# Altium project LTE-GNSS Asset Tracker.PrjPcb (part 2 of 3)

## Sheet Battery.SchDoc
size A4
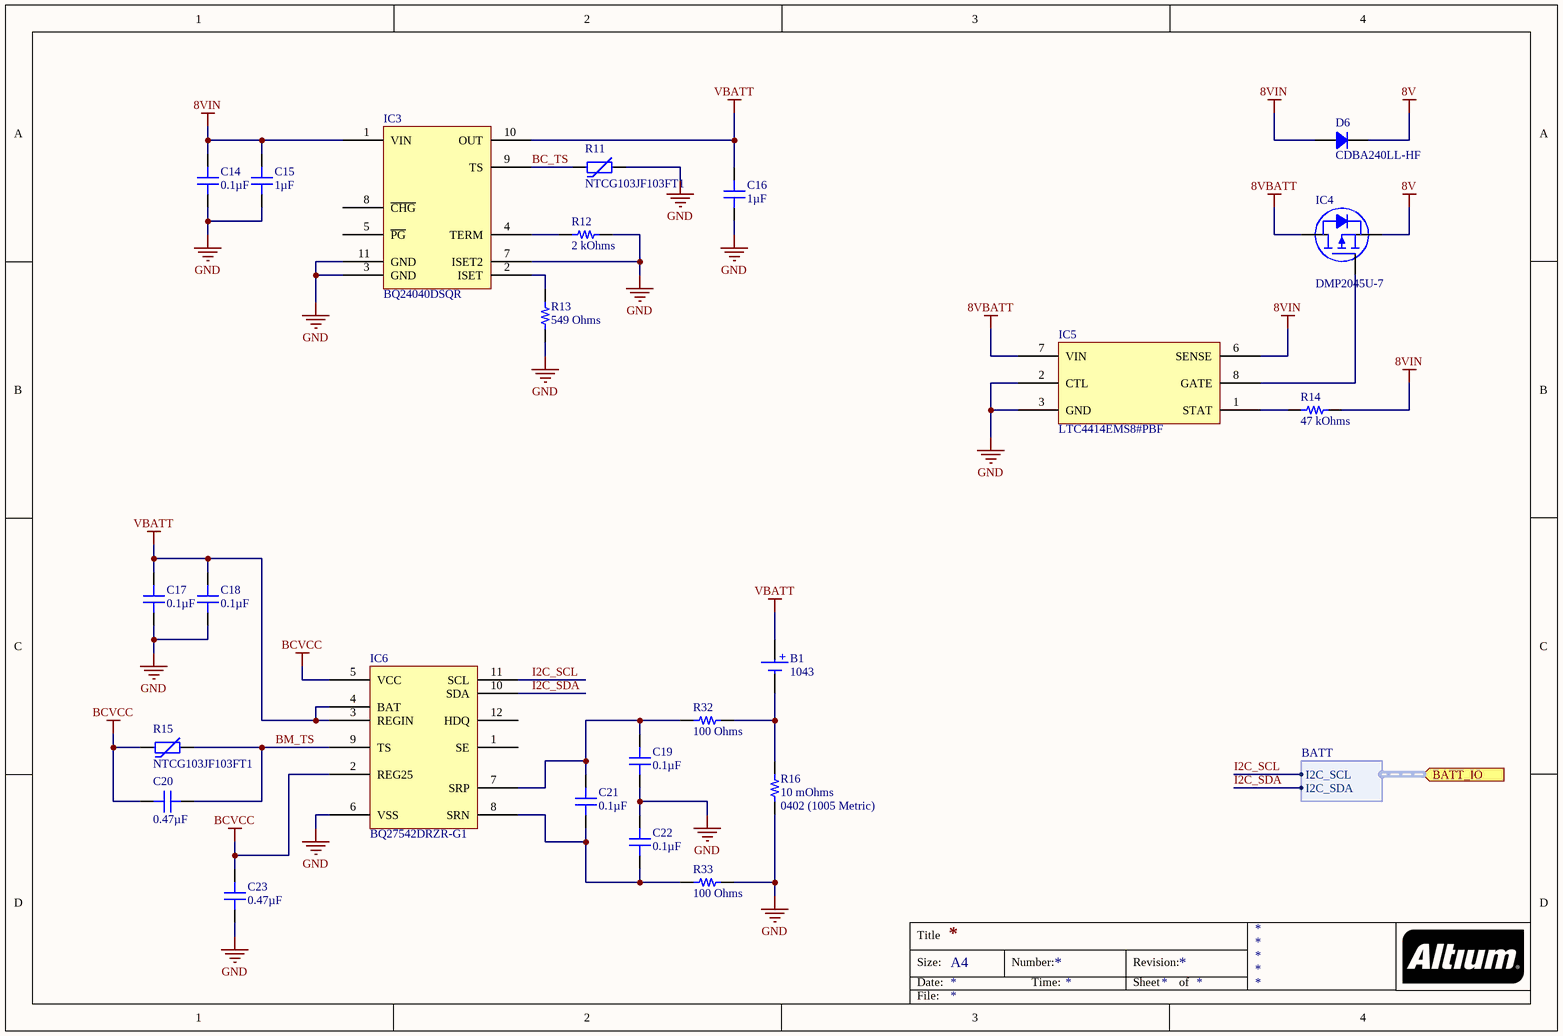
[diagram p3: Battery.SchDoc]

### Parts
B1  1043  [KEYSTONE 1043]
C14  0.1µF  [CAP 0201_0603]
C15  1µF  [CAP 0402_1005]
C16  1µF  [CAP 0402_1005]
C17  0.1µF  [CAP 0201_0603]
C18  0.1µF  [CAP 0201_0603]
C19  0.1µF  [CAP 0201_0603]
C20  0.47µF  [CAP 0201_0603]
C21  0.1µF  [CAP 0201_0603]
C22  0.1µF  [CAP 0201_0603]
C23  0.47µF  [CAP 0201_0603]
D6  CDBA240LL-HF  [DO214AC SMA]
IC3  BQ24040DSQR  [TI PWSON-10 DSQ]
IC4  DMP2045U-7  [DIODES SOT-23-3]
IC5  LTC4414EMS8#PBF  [ANALOG MSOP-8 RM-8]
IC6  BQ27542DRZR-G1  [TI SON-12 DRZ]
R11  NTCG103JF103FT1  [NTC 0402_1005]
R12  2 kOhms  [RES 0201_0603]
R13  549 Ohms  [RES 0201_0603]
R14  47 kOhms  [RES 0201_0603]
R15  NTCG103JF103FT1  [NTC 0402_1005]
R16  10 mOhms  Package / Case: 0402 (1005 Metric)  [STACKPOLE CSR0402]
R32  100 Ohms  [RES 0201_0603]
R33  100 Ohms  [RES 0201_0603]

### Ports
BATT_IO (in, harness BATT)

### Harnesses
BATT: I2C_SCL, I2C_SDA

### Nets
8V: D6.2 IC4.2(S)
8VBATT: IC4.3(D) IC5.7(VIN)
8VIN: C14.2 C15.2 D6.1 IC3.1(VIN) IC5.6(SENSE) R14.2
BCVCC: C20.1 C23.2 IC6.2(REG25) IC6.5(VCC) R15.1
GND: C14.1 C15.1 C16.1 C17.1 C18.1 C19.1 C22.2 C23.1 IC3.3(GND) IC3.7(ISET2) IC3.11(GND) IC5.2(CTL) IC5.3(GND) IC6.6(VSS) R11.2 R12.2 R13.1 R16.1 R33.2
VBATT: B1.1(+) C16.2 C17.2 C18.2 IC3.10(OUT) IC6.3(REGIN) IC6.4(BAT)
BC_TS: IC3.9(TS) R11.1
BM_TS: C20.2 IC6.9(TS) R15.2
I2C_SCL: IC6.11(SCL) ; port BATT_IO.I2C_SCL
I2C_SDA: IC6.10(SDA) ; port BATT_IO.I2C_SDA
NetB1_2: B1.2(-) R16.2 R32.2
NetC19_2: C19.2 C21.2 IC6.7(SRP) R32.1
NetC21_1: C21.1 C22.1 IC6.8(SRN) R33.1
NetIC3_2: IC3.2(ISET) R13.2
NetIC3_4: IC3.4(TERM) R12.1
NetIC4_1: IC4.1(G) IC5.8(GATE)
NetIC5_1: IC5.1(STAT) R14.1

Not connected (* = marked no-connect by the designer): IC3 5(~{PG}) 8(~{CHG}); IC6 1(SE) 12(HDQ)

### Notes on the sheet
- Title
- Size:
- Date:
- A4
- Number:
- Time:
- Revision:
- Sheet
- of
- File:

### Library data of the parts
B1 = 1043: BATTERY HOLDER 18650 PC PIN; Manufacturer: Keystone Electronics; Battery Cell Size: 18650; Battery Type, Function: Cylindrical, Holder; Number of Cells: 1; Style: Holder (Open); Part Number: 1043; ComponentLink1Description: Datasheet; ComponentLink1URL: http://keyelco.com/userAssets/file/M65p27.pdf; ComponentLink2Description: DigiKey Link; ComponentLink2URL: http://digikey.com/product-detail/en/keystone-electronics/1043/36-1043-ND/2745669; Height Above Board: 0.585" (14.86mm); LastUpdated: 02/02/2020 09:19:56; Lifecycle Status: Active; Minimum Order: 1; Mounting Type: PCB, Through Hole; Operating Temperature: -50°C ~ 145°C; Packaging: Unknown; PartId: 2; Part Status: Active; Price: 2.58; Series: -; Supplier 1: DigiKey; Supplier Part Number 1: 36-1043-ND; Termination Style: PC Pin
C14 C17-C19 C21 C22 = GRM033R61C104ME84D: CAP CER 0.1UF 16V X5R 0201; Manufacturer: Murata Electronics; Tolerance: ±20%; Part Number: GRM033R61C104ME84D; Value: 0.1µF; Applications: General Purpose; Capacitance: 0.1µF; ComponentLink1Description: Datasheet; ComponentLink1URL: https://search.murata.co.jp/Ceramy/image/img/A01X/G101/ENG/GRM033R61C104ME84-01.pdf; ComponentLink2Description: DigiKey Link; ComponentLink2URL: http://digikey.com/product-detail/en/murata-electronics/GRM033R61C104ME84D/490-9986-1-ND/5026291; Device Package: 0201 (0603 Metric); LastUpdated: 21/01/2020 00:00:12; Lifecycle Status: Active; Minimum Order: 1; Mounting Type: Surface Mount, MLCC; Operating Temperature: -55°C ~ 85°C; Package / Case: 0201 (0603 Metric); Packaging: TapeAndReel; PartId: 1522; Part Status: Active; Price: 0.01; Series: GRM; Size / Dimension: 0.024" L x 0.012" W (0.60mm x 0.30mm); Supplier 1: DigiKey; Supplier Part Number 1: 490-9986-1-ND; Temperature Coefficient: X5R; Thickness (Max): 0.013" (0.33mm); Voltage - Rated: 16V
C15 C16 = GRM155R61C105MA12D: CAP CER 1UF 16V X5R 0402; Manufacturer: Murata Electronics; Tolerance: ±20%; Part Number: GRM155R61C105MA12D; Value: 1µF; Applications: General Purpose; Capacitance: 1µF; ComponentLink1Description: Datasheet; ComponentLink1URL: https://search.murata.co.jp/Ceramy/image/img/A01X/G101/ENG/GRM155R61C105MA12-01.pdf; ComponentLink2Description: DigiKey Link; ComponentLink2URL: http://digikey.com/product-detail/en/murata-electronics/GRM155R61C105MA12D/490-14599-1-ND/6606205; Device Package: 0402 (1005 Metric); LastUpdated: 01/04/2020 23:56:41; Lifecycle Status: Active; Minimum Order: 1; Mounting Type: Surface Mount, MLCC; Operating Temperature: -55°C ~ 85°C; Package / Case: 0402 (1005 Metric); Packaging: TapeAndReel; PartId: 10295; Part Status: Active; Price: 0.01; Series: GRM; Size / Dimension: 0.039" L x 0.020" W (1.00mm x 0.50mm); Supplier 1: DigiKey; Supplier Part Number 1: 490-14599-1-ND; Temperature Coefficient: X5R; Thickness (Max): 0.022" (0.55mm); Voltage - Rated: 16V
C20 C23 = GRM033R60J474ME90D: CAP CER 0.47UF 6.3V X5R 0201; Manufacturer: Murata Electronics; Tolerance: ±20%; Part Number: GRM033R60J474ME90D; Value: 0.47µF; Applications: General Purpose; Capacitance: 0.47µF; ComponentLink1Description: Datasheet; ComponentLink1URL: https://search.murata.co.jp/Ceramy/image/img/A01X/G101/ENG/GRM033R60J474ME90-01.pdf; ComponentLink2Description: DigiKey Link; ComponentLink2URL: http://digikey.com/product-detail/en/murata-electronics/GRM033R60J474ME90D/490-10410-1-ND/5026287; Device Package: 0201 (0603 Metric); LastUpdated: 21/01/2020 00:00:17; Lifecycle Status: Active; Minimum Order: 1; Mounting Type: Surface Mount, MLCC; Operating Temperature: -55°C ~ 85°C; Package / Case: 0201 (0603 Metric); Packaging: TapeAndReel; PartId: 705; Part Status: Active; Price: 0.02; Series: GRM; Size / Dimension: 0.024" L x 0.012" W (0.60mm x 0.30mm); Supplier 1: DigiKey; Supplier Part Number 1: 490-10410-1-ND; Temperature Coefficient: X5R; Thickness (Max): 0.013" (0.33mm); Voltage - Rated: 6.3V
D6 = CDBA240LL-HF: DIODE SCHOTTKY 40V 2A DO214AC; Manufacturer: Comchip Technology; Capacitance @ Vr, F: 160pF @ 4V, 1MHz; Current - Average Rectified (Io): 2A (DC); Current - Reverse Leakage @ Vr: 1mA @ 40V; Speed: Fast Recovery =< 500ns, > 200mA (Io); Voltage - Forward (Vf) (Max) @ If: 350mV @ 2A; Part Number: CDBA240LL-HF; ComponentLink1Description: Datasheet; ComponentLink1URL: http://www.comchiptech.com/admin/files/product/CDBA240LL-HF RevC514247.pdf; ComponentLink2Description: DigiKey Link; ComponentLink2URL: http://digikey.com/product-detail/en/comchip-technology/CDBA240LL-HF/641-1698-1-ND/5226081; Device Package: DO-214AC, SMA; Diode Type: Schottky; LastUpdated: 02/02/2020 10:17:39; Lifecycle Status: Active; Minimum Order: 1; Mounting Type: Surface Mount; Operating Temperature - Junction: -55°C ~ 100°C; Package / Case: DO-214AC, SMA; Packaging: TapeAndReel; PartId: 2082; Part Status: Active; Price: 0.15; Series: -; Supplier 1: DigiKey; Supplier Part Number 1: 641-1698-1-ND; Supplier Device Package: DO-214AC (SMA); Voltage - DC Reverse (Vr) (Max): 40V
IC3 = BQ24040DSQR: IC BATT CHG LI-ION 1 CELL 10SON; Manufacturer: Texas Instruments; Battery Chemistry: Lithium Ion/Polymer; Battery Pack Voltage: 4.2V; Charge Current - Max: 1A; Current - Charging: Constant - Programmable; Fault Protection: Over Temperature, Over Voltage, Short Circuit; Number of Cells: 1; Programmable Features: Current; Voltage - Supply (Max): 28V; Part Number: BQ24040DSQR; ComponentLink1Description: Datasheet; ComponentLink1URL: http://www.ti.com/general/docs/suppproductinfo.tsp?distId=10&gotoUrl=http%3A%2F%2Fwww.ti.com%2Flit%2Fgpn%2Fbq24040; ComponentLink2Description: DigiKey Link; ComponentLink2URL: //digikey.com/product-detail/en/texas-instruments/BQ24040DSQR/296-37142-2-ND/2231631; Device Package: 10-WFDFN Exposed Pad; LastUpdated: 03/12/2019 23:44:47; Lifecycle Status: 0; Minimum Order: 1; Mounting Type: Surface Mount; Operating Temperature: -40°C ~ 85°C (TA); Package / Case: 10-WFDFN Exposed Pad; Packaging: TapeAndReel; PartId: 3; Part Status: Active; Price: 0.49; Series: -; Supplier 1: DigiKey; Supplier Part Number 1: 296-37142-2-ND; Supplier Device Package: 10-SON (2x2)
IC4 = DMP2045U-7: MOSFET P-CHAN 24V SOT23; Manufacturer: Diodes Incorporated; Current - Continuous Drain (Id) @ 25°C: 4.3A (Ta); Drain to Source Voltage (Vdss): 20V; Drive Voltage (Max Rds On,  Min Rds On): 1.8V, 4.5V; FET Type: P-Channel; Gate Charge (Qg) (Max) @ Vgs: 6.8nC @ 4.5V; Input Capacitance (Ciss) (Max) @ Vds: 634pF @ 10V; Power Dissipation (Max): 800mW (Ta); Rds On (Max) @ Id, Vgs: 45mOhm @ 4A, 4.5V; Vgs (Max): ±8V; Vgs(th) (Max) @ Id: 1V @ 250µA; Part Number: DMP2045U-7; ComponentLink1Description: Datasheet; ComponentLink1URL: https://www.diodes.com/assets/Datasheets/DMP2045U.pdf; ComponentLink2Description: DigiKey Link; ComponentLink2URL: http://digikey.com/product-detail/en/diodes-incorporated/DMP2045U-7/DMP2045U-7DICT-ND/8275359; Device Package: TO-236-3, SC-59, SOT-23-3; LastUpdated: 21/01/2020 04:00:36; Lifecycle Status: Active; Minimum Order: 1; Mounting Type: Surface Mount; Operating Temperature: -55°C ~ 150°C (TJ); Package / Case: TO-236-3, SC-59, SOT-23-3; Packaging: TapeAndReel; Part Status: Active; Price: 0.08; Series: -; Supplier 1: DigiKey; Supplier Part Number 1: DMP2045U-7DICT-ND; Supplier Device Package: SOT-23; Technology: MOSFET (Metal Oxide)
IC5 = LTC4414EMS8#PBF: IC OR CTRLR SRC SELECT 8MSOP; Manufacturer: Linear Technology/Analog Devices; Current - Supply: 33µA; Delay Time - OFF: 20µs; Delay Time - ON: 600µs; FET Type: P-Channel; Internal Switch(s): No; Ratio - Input:Output: 2:1; Voltage - Supply: 3V ~ 36V; Applications: Battery Backup, Industrial/Automotive, High Current Switch; ComponentLink1Description: Datasheet; ComponentLink1URL: http://www.linear.com/docs/9037; ComponentLink2Description: DigiKey Link; ComponentLink2URL: http://digikey.com/product-detail/en/linear-technology-analog-devices/LTC4414EMS8-PBF/LTC4414EMS8-PBF-ND/1620230; Device Package: 8-TSSOP, 8-MSOP (0.118", 3.00mm Width); LastUpdated: 02/02/2020 11:30:26; Lifecycle Status: Active; Part Number: LTC4414EMS8#PBF; Minimum Order: 1; Mounting Type: Surface Mount; Operating Temperature: -40°C ~ 85°C; Package / Case: 8-TSSOP, 8-MSOP (0.118", 3.00mm Width); Packaging: Tube; Part Status: Active; Price: 4.49; Series: PowerPath™; Supplier 1: DigiKey; Supplier Part Number 1: LTC4414EMS8#PBF-ND; Supplier Device Package: 8-MSOP; Type: Source Selector Switch
IC6 = BQ27542DRZR-G1: IC BATT FUEL GAUGE LI-ION 12SON; Manufacturer: Texas Instruments; Battery Chemistry: Lithium-Ion; Function: Battery Monitor; Interface: HDQ, I²C; Number of Cells: 1; Part Number: BQ27542DRZR-G1; ComponentLink1Description: Datasheet; ComponentLink1URL: http://www.ti.com/general/docs/suppproductinfo.tsp?distId=10&gotoUrl=http%3A%2F%2Fwww.ti.com%2Flit%2Fgpn%2Fbq27542-g1; ComponentLink2Description: DigiKey Link; ComponentLink2URL: http://digikey.com/product-detail/en/texas-instruments/BQ27542DRZR-G1/296-44346-1-ND/6110619; Device Package: 12-VFDFN Exposed Pad; LastUpdated: 30/03/2020 16:23:27; Lifecycle Status: Active; Minimum Order: 1; Mounting Type: Surface Mount; Operating Temperature: -40°C ~ 85°C (TA); Package / Case: 12-VFDFN Exposed Pad; Packaging: TapeAndReel; Part Status: Active; Price: 1.28; Series: Impedance Track™; Supplier 1: DigiKey; Supplier Part Number 1: 296-44346-1-ND; Supplier Device Package: 12-SON (2.5x4)
R11 R15 = NTCG103JF103FT1: THERMISTOR NTC 10KOHM 3380K 0402; Manufacturer: TDK Corporation; B25/85: 3435K; B Value Tolerance: ±1%; Power - Max: 100mW; Resistance in Ohms @ 25°C: 10k; Part Number: NTCG103JF103FT1; B25/50: 3380K; ComponentLink1Description: Datasheet; ComponentLink1URL: https://product.tdk.com/info/en/catalog/datasheets/503021/tpd_commercial_ntc-thermistor_ntcg_en.pdf?ref_disty=digikey; ComponentLink2Description: DigiKey Link; ComponentLink2URL: http://digikey.com/product-detail/en/tdk-corporation/NTCG103JF103FT1/445-2550-1-ND/934249; Device Package: 0402 (1005 Metric); LastUpdated: 21/01/2020 03:30:28; Lifecycle Status: Active; Minimum Order: 1; Mounting Type: Surface Mount; Operating Temperature: -40°C ~ 125°C; Package / Case: 0402 (1005 Metric); Packaging: TapeAndReel; PartId: 199; Part Status: Active; Price: 0.03; Resistance Tolerance: ±1%; Series: NTCG; Supplier 1: DigiKey; Supplier Part Number 1: 445-2550-1-ND
R12 = ERJ-1GNF2001C: RES SMD 2K OHM 1% 1/20W 0201; Manufacturer: Panasonic Electronic Components; Power (Watts): 0.05W, 1/20W; Temperature Coefficient: ±200ppm/°C; Part Number: ERJ-1GNF2001C; Value: 2 kOhms; ComponentLink1Description: Datasheet; ComponentLink1URL: https://industrial.panasonic.com/cdbs/www-data/pdf/RDA0000/AOA0000C304.pdf; ComponentLink2Description: DigiKey Link; ComponentLink2URL: http://digikey.com/product-detail/en/panasonic-electronic-components/ERJ-1GNF2001C/P122812CT-ND/8342563; Composition: Thick Film; Device Package: 0201 (0603 Metric); Features: Automotive AEC-Q200; Height - Seated (Max): 0.010" (0.26mm); LastUpdated: 21/01/2020 00:04:11; Lifecycle Status: Active; Minimum Order: 1; Number of Terminations: 2; Operating Temperature: -55°C ~ 125°C; Package / Case: 0201 (0603 Metric); Packaging: TapeAndReel; PartId: 3463; Part Status: Active; Price: 0.01; Ratings: AEC-Q200; Resistance: 2 kOhms; Series: ERJ; Size / Dimension: 0.024" L x 0.012" W (0.60mm x 0.30mm); Supplier 1: DigiKey; Supplier Part Number 1: P122812CT-ND; Supplier Device Package: 0201; Tolerance: ±1%
R13 = ERJ-1GNF5490C: RES SMD 549 OHM 1% 1/20W 0201; Manufacturer: Panasonic Electronic Components; Power (Watts): 0.05W, 1/20W; Temperature Coefficient: ±200ppm/°C; Part Number: ERJ-1GNF5490C; Value: 549 Ohms; ComponentLink1Description: Datasheet; ComponentLink1URL: https://industrial.panasonic.com/cdbs/www-data/pdf/RDA0000/AOA0000C304.pdf; ComponentLink2Description: DigiKey Link; ComponentLink2URL: http://digikey.com/product-detail/en/panasonic-electronic-components/ERJ-1GNF5490C/P123070CT-ND/8343079; Composition: Thick Film; Device Package: 0201 (0603 Metric); Features: Automotive AEC-Q200; Height - Seated (Max): 0.010" (0.26mm); LastUpdated: 21/01/2020 00:04:10; Lifecycle Status: Active; Minimum Order: 1; Number of Terminations: 2; Operating Temperature: -55°C ~ 125°C; Package / Case: 0201 (0603 Metric); Packaging: TapeAndReel; PartId: 4182; Part Status: Active; Price: 0.01; Ratings: AEC-Q200; Resistance: 549 Ohms; Series: ERJ; Size / Dimension: 0.024" L x 0.012" W (0.60mm x 0.30mm); Supplier 1: DigiKey; Supplier Part Number 1: P123070CT-ND; Supplier Device Package: 0201; Tolerance: ±1%
R14 = ERJ-1GNF4702C: RES SMD 47K OHM 1% 1/20W 0201; Manufacturer: Panasonic Electronic Components; Power (Watts): 0.05W, 1/20W; Temperature Coefficient: ±200ppm/°C; Part Number: ERJ-1GNF4702C; Value: 47 kOhms; ComponentLink1Description: Datasheet; ComponentLink1URL: https://industrial.panasonic.com/cdbs/www-data/pdf/RDA0000/AOA0000C304.pdf; ComponentLink2Description: DigiKey Link; ComponentLink2URL: http://digikey.com/product-detail/en/panasonic-electronic-components/ERJ-1GNF4702C/P123032CT-ND/8343003; Composition: Thick Film; Device Package: 0201 (0603 Metric); Features: Automotive AEC-Q200; Height - Seated (Max): 0.010" (0.26mm); LastUpdated: 21/01/2020 00:04:13; Lifecycle Status: Active; Minimum Order: 1; Number of Terminations: 2; Operating Temperature: -55°C ~ 125°C; Package / Case: 0201 (0603 Metric); Packaging: TapeAndReel; PartId: 2322; Part Status: Active; Price: 0.01; Ratings: AEC-Q200; Resistance: 47 kOhms; Series: ERJ; Size / Dimension: 0.024" L x 0.012" W (0.60mm x 0.30mm); Supplier 1: DigiKey; Supplier Part Number 1: P123032CT-ND; Supplier Device Package: 0201; Tolerance: ±1%
R16 = ERJ-2LWFR010X: RES 0.01 OHM 1% 1/5W 0402; Manufacturer: Panasonic Electronic Components; Power (Watts): 0.2W, 1/5W; Temperature Coefficient: 0/ +500ppm/°C; Part Number: ERJ-2LWFR010X; ComponentLink1Description: Datasheet; ComponentLink1URL: https://industrial.panasonic.com/cdbs/www-data/pdf/RDN0000/AOA0000C313.pdf; ComponentLink2Description: DigiKey Link; ComponentLink2URL: http://digikey.com/product-detail/en/panasonic-electronic-components/ERJ-2LWFR010X/P19181CT-ND/6004536; Composition: Thick Film; Device Package: 0402 (1005 Metric); Features: Current Sense; Height - Seated (Max): 0.018" (0.45mm); LastUpdated: 21/01/2020 02:16:15; Lifecycle Status: Active; Minimum Order: 1; Number of Terminations: 2; Operating Temperature: -55°C ~ 125°C; Packaging: TapeAndReel; PartId: 348; Part Status: Active; Price: 0.05; Resistance: 10 mOhms; Series: ERJ; Size / Dimension: 0.039" L x 0.020" W (1.00mm x 0.50mm); Supplier 1: DigiKey; Supplier Part Number 1: P19181CT-ND; Supplier Device Package: 0402; Tolerance: ±1%; Value: 10 mOhms
R32 R33 = RK73H1HTTC1000F: RES 100 OHM 1% 1/20W 0201; Manufacturer: KOA Speer Electronics, Inc.; Power (Watts): 0.05W, 1/20W; Temperature Coefficient: ±200ppm/°C; Part Number: RK73H1HTTC1000F; Value: 100 Ohms; ComponentLink1Description: Datasheet; ComponentLink1URL: http://www.koaspeer.com/catimages/Products/RK73H/RK73H.pdf; ComponentLink2Description: DigiKey Link; ComponentLink2URL: http://digikey.com/product-detail/en/koa-speer-electronics-inc/RK73H1HTTC1000F/2019-RK73H1HTTC1000FCT-ND/9845801; Composition: Thick Film; Device Package: 0201 (0603 Metric); Features: Automotive AEC-Q200, Moisture Resistant; Height - Seated (Max): 0.010" (0.26mm); LastUpdated: 21/01/2020 00:04:16; Lifecycle Status: Active; Minimum Order: 1; Number of Terminations: 2; Operating Temperature: -55°C ~ 155°C; Package / Case: 0201 (0603 Metric); Packaging: TapeAndReel; PartId: 1552; Part Status: Active; Price: 0.01; Ratings: AEC-Q200; Resistance: 100 Ohms; Series: RK73H; Size / Dimension: 0.024" L x 0.012" W (0.60mm x 0.30mm); Supplier 1: DigiKey; Supplier Part Number 1: 2019-RK73H1HTTC1000FCT-ND; Supplier Device Package: 0201; Tolerance: ±1%

## Sheet CAN.SchDoc
size A4
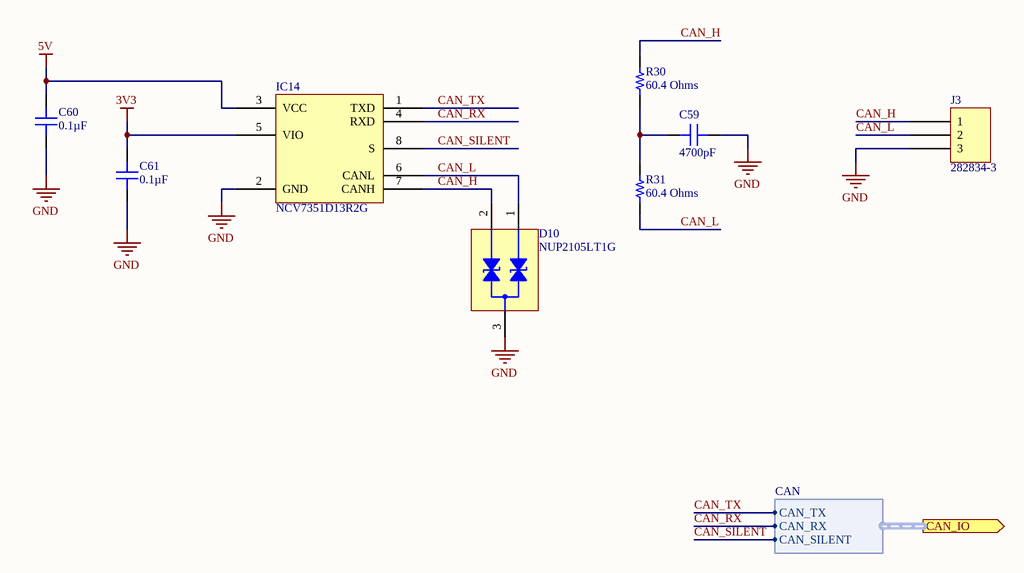
[diagram p4: CAN.SchDoc]

### Parts
C59  4700pF  [CAP 0201_0603]
C60  0.1µF  [CAP 0201_0603]
C61  0.1µF  [CAP 0201_0603]
D10  NUP2105LT1G  [ON SEMI SOT-23-3]
IC14  NCV7351D13R2G  [ON SEMI - SOIC-8 751AZ]
J3  282834-3  [TE 282834-3]
R30  60.4 Ohms  [RES 0201_0603]
R31  60.4 Ohms  [RES 0201_0603]

### Ports
CAN_IO (out, harness CAN)

### Harnesses
CAN: CAN_TX, CAN_RX, CAN_SILENT

### Nets
3V3: C61.2 IC14.5(VIO)
5V: C60.2 IC14.3(VCC)
GND: C59.2 C60.1 C61.1 D10.3(I/O_2) IC14.2(GND) J3.3
CAN_H: D10.2(GND) IC14.7(CANH) J3.1 R30.1
CAN_L: D10.1(I/O_1) IC14.6(CANL) J3.2 R31.2
CAN_RX: IC14.4(RXD) ; port CAN_IO.CAN_RX
CAN_SILENT: IC14.8(S) ; port CAN_IO.CAN_SILENT
CAN_TX: IC14.1(TXD) ; port CAN_IO.CAN_TX
NetC59_1: C59.1 R30.2 R31.1

### Notes on the sheet
- Title
- Size:
- Date:
- A4
- Number:
- Time:
- Revision:
- Sheet
- of
- File:

### Library data of the parts
C59 = GRM033R71E472KE14D: CAP CER 4700PF 25V X7R 0201; Manufacturer: Murata Electronics; Tolerance: ±10%; Part Number: GRM033R71E472KE14D; Value: 4700pF; Applications: General Purpose; Capacitance: 4700pF; ComponentLink1Description: Datasheet; ComponentLink1URL: https://search.murata.co.jp/Ceramy/image/img/A01X/G101/ENG/GRM033R71E472KE14-01.pdf; ComponentLink2Description: DigiKey Link; ComponentLink2URL: http://digikey.com/product-detail/en/murata-electronics/GRM033R71E472KE14D/490-14455-1-ND/6606916; Device Package: 0201 (0603 Metric); LastUpdated: 21/01/2020 00:00:16; Lifecycle Status: Active; Minimum Order: 1; Mounting Type: Surface Mount, MLCC; Operating Temperature: -55°C ~ 125°C; Package / Case: 0201 (0603 Metric); Packaging: CutTape; PartId: 986; Part Status: Active; Price: 0.10; Series: GRM; Size / Dimension: 0.024" L x 0.012" W (0.60mm x 0.30mm); Supplier 1: DigiKey; Supplier Part Number 1: 490-14455-1-ND; Temperature Coefficient: X7R; Thickness (Max): 0.013" (0.33mm); Voltage - Rated: 25V
C60 C61 = GRM033R61C104ME84D: as C14 on sheet Battery; Part Number: GRM033R61C104ME84D; Value: 0.1µF; Applications: General Purpose; Capacitance: 0.1µF; ComponentLink1Description: Datasheet; ComponentLink1URL: https://search.murata.co.jp/Ceramy/image/img/A01X/G101/ENG/GRM033R61C104ME84-01.pdf; ComponentLink2Description: DigiKey Link; ComponentLink2URL: http://digikey.com/product-detail/en/murata-electronics/GRM033R61C104ME84D/490-9986-1-ND/5026291; Device Package: 0201 (0603 Metric); LastUpdated: 21/01/2020 00:00:12; Lifecycle Status: Active; Minimum Order: 1; Mounting Type: Surface Mount, MLCC; Operating Temperature: -55°C ~ 85°C; Package / Case: 0201 (0603 Metric); Packaging: TapeAndReel; PartId: 1522; Part Status: Active; Price: 0.01; Series: GRM; Size / Dimension: 0.024" L x 0.012" W (0.60mm x 0.30mm); Supplier 1: DigiKey; Supplier Part Number 1: 490-9986-1-ND; Temperature Coefficient: X5R; Thickness (Max): 0.013" (0.33mm); Voltage - Rated: 16V
D10 = NUP2105LT1G: TVS DIODE 24V 44V SOT23-3; Manufacturer: ON Semiconductor; Bidirectional Channels: 2; Capacitance @ Frequency: 30pF @ 1MHz; Current - Peak Pulse (10/1000µs): 8A (8/20µs); Power Line Protection: No; Power - Peak Pulse: 350W; Type: Zener; Voltage - Breakdown (Min): 26.2V; Voltage - Reverse Standoff (Typ): 24V (Min); Part Number: NUP2105LT1G; Applications: General Purpose; ComponentLink1Description: Datasheet; ComponentLink1URL: http://www.onsemi.com/pub/Collateral/NUP2105L-D.PDF; ComponentLink2Description: DigiKey Link; ComponentLink2URL: http://digikey.com/product-detail/en/on-semiconductor/NUP2105LT1G/NUP2105LT1GOSCT-ND/1485001; Device Package: TO-236-3, SC-59, SOT-23-3; LastUpdated: 30/03/2020 16:33:57; Lifecycle Status: Active; Minimum Order: 1; Mounting Type: Surface Mount; Operating Temperature: -55°C ~ 150°C (TJ); Package / Case: TO-236-3, SC-59, SOT-23-3; Packaging: TapeAndReel; PartId: 10506; Part Status: Active; Price: 0.09; Series: -; Supplier 1: DigiKey; Supplier Part Number 1: NUP2105LT1GOSCT-ND; Supplier Device Package: SOT-23-3 (TO-236); Voltage - Clamping (Max) @ Ipp: 44V
IC14 = NCV7351D13R2G: IC TRANSCEIVER HALF 1/1 8SOIC; Manufacturer: ON Semiconductor; Protocol: CANbus; Voltage - Supply: 4.5V ~ 5.5V; Part Number: NCV7351D13R2G; ComponentLink1Description: Datasheet; ComponentLink1URL: http://www.onsemi.com/pub/Collateral/NCV7351-D.PDF; ComponentLink2Description: DigiKey Link; ComponentLink2URL: http://digikey.com/product-detail/en/on-semiconductor/NCV7351D13R2G/NCV7351D13R2GOSCT-ND/4707705; Device Package: 8-SOIC (0.154", 3.90mm Width); Duplex: Half; LastUpdated: 30/03/2020 16:32:13; Lifecycle Status: Active; Minimum Order: 1; Mounting Type: Surface Mount; Number of Drivers/Receivers: 1/1; Operating Temperature: -40°C ~ 125°C; Package / Case: 8-SOIC (0.154", 3.90mm Width); Packaging: TapeAndReel; Part Status: Active; Price: 0.36; Series: Automotive, AEC-Q100; Supplier 1: DigiKey; Supplier Part Number 1: NCV7351D13R2GOSCT-ND; Supplier Device Package: 8-SOIC; Type: Transceiver
J3 = 282834-3: TERM BLK 3P SIDE ENT 2.54MM PCB; Manufacturer: TE Connectivity AMP Connectors; Current: 10A; Mating Orientation: Horizontal with Board; Number of Levels: 1; Pitch: 0.100" (2.54mm); Positions Per Level: 3; Voltage: 150V; Wire Gauge: 16-30 AWG; Wire Termination: Screw - Rising Cage Clamp; Part Number: 282834-3; Color: Green; ComponentLink1Description: Datasheet; ComponentLink1URL: https://www.te.com/commerce/DocumentDelivery/DDEController?Action=srchrtrv&DocNm=282834&DocType=Customer+Drawing&DocLang=English; ComponentLink2Description: DigiKey Link; ComponentLink2URL: http://digikey.com/product-detail/en/te-connectivity-amp-connectors/282834-3/A98334-ND/1153264; LastUpdated: 15/01/2020 04:15:50; Lifecycle Status: Active; Minimum Order: 1; Mounting Type: Through Hole; Packaging: Bulk; Part Status: Active; Price: 2.01; Series: Buchanan; Supplier 1: DigiKey; Supplier Part Number 1: A98334-ND
R30 R31 = ERJ-1GNF60R4C: RES SMD 60.4 OHM 1% 1/20W 0201; Manufacturer: Panasonic Electronic Components; Power (Watts): 0.05W, 1/20W; Temperature Coefficient: ±200ppm/°C; Part Number: ERJ-1GNF60R4C; Value: 60.4 Ohms; ComponentLink1Description: Datasheet; ComponentLink1URL: https://industrial.panasonic.com/cdbs/www-data/pdf/RDA0000/AOA0000C304.pdf; ComponentLink2Description: DigiKey Link; ComponentLink2URL: http://digikey.com/product-detail/en/panasonic-electronic-components/ERJ-1GNF60R4C/P123098CT-ND/8343135; Composition: Thick Film; Device Package: 0201 (0603 Metric); Features: Automotive AEC-Q200; Height - Seated (Max): 0.010" (0.26mm); LastUpdated: 21/01/2020 00:04:11; Lifecycle Status: Active; Minimum Order: 1; Number of Terminations: 2; Operating Temperature: -55°C ~ 125°C; Package / Case: 0201 (0603 Metric); Packaging: TapeAndReel; PartId: 3528; Part Status: Active; Price: 0.01; Ratings: AEC-Q200; Resistance: 60.4 Ohms; Series: ERJ; Size / Dimension: 0.024" L x 0.012" W (0.60mm x 0.30mm); Supplier 1: DigiKey; Supplier Part Number 1: P123098CT-ND; Supplier Device Package: 0201; Tolerance: ±1%

## Sheet LTE Module.SchDoc
size A4
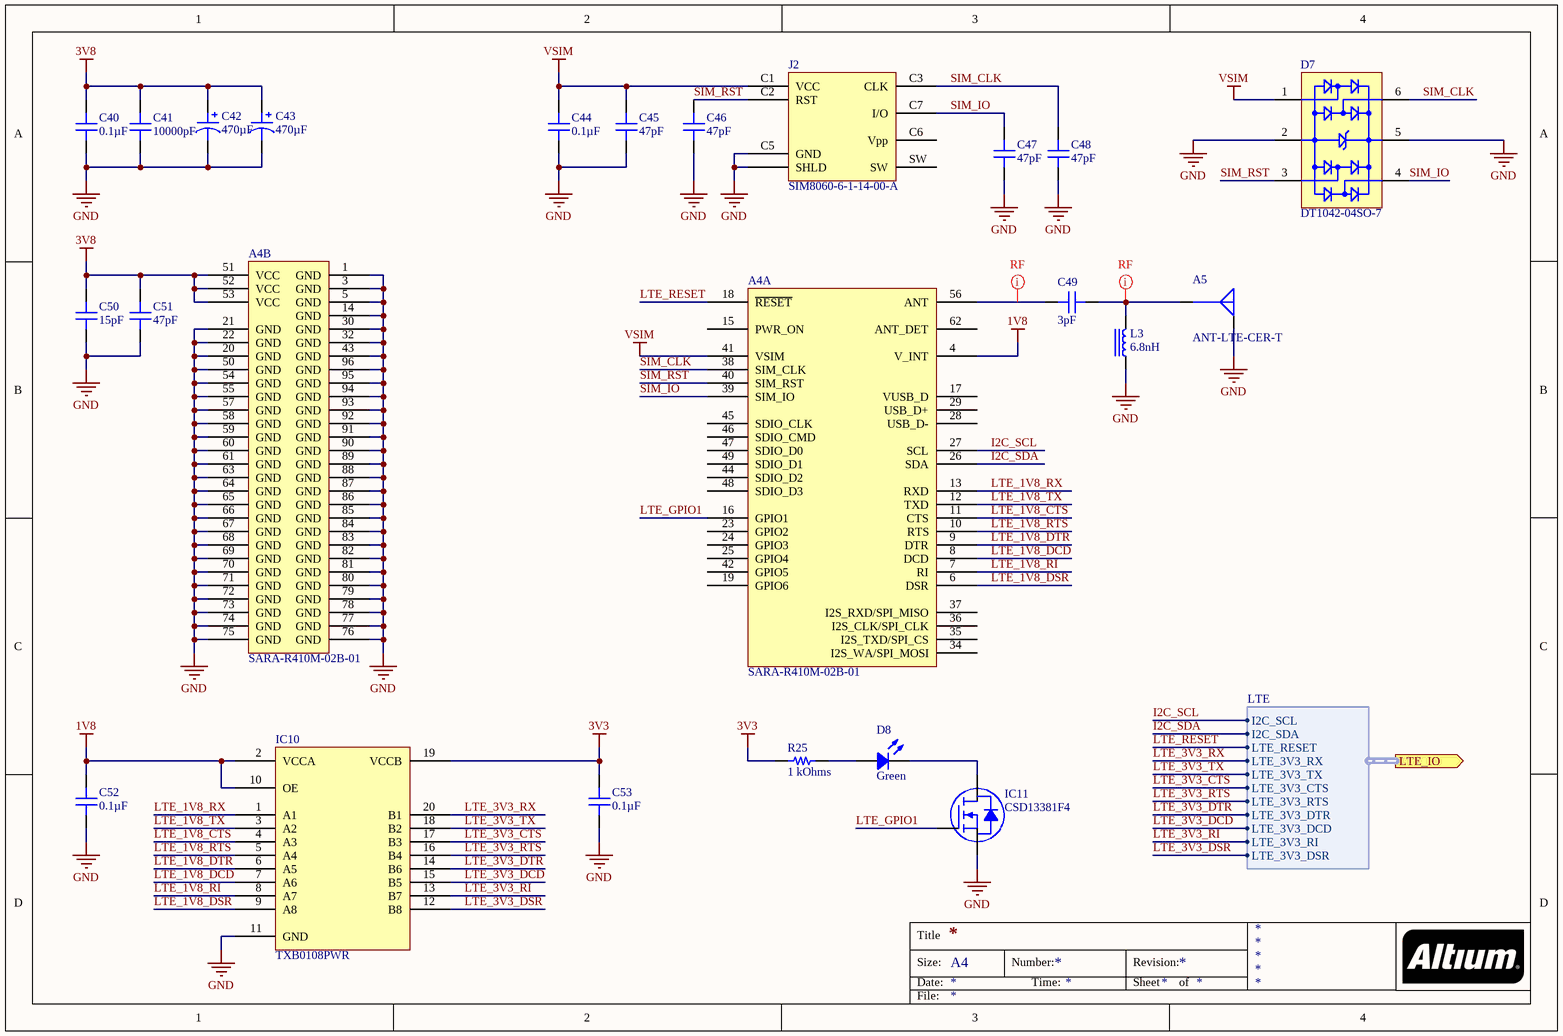
[diagram p5: LTE Module.SchDoc]

### Parts
A4  SARA-R410M-02B-01  [U-BLOX SARA-R4]  (parts A,B of 2)
A5  ANT-LTE-CER-T  [LINX ANT-LTE-CER-T]
C40  0.1µF  [CAP 0201_0603]
C41  10000pF  [CAP 0201_0603]
C42  470µF  [CAP POL 1411_3528]
C43  470µF  [CAP POL 1411_3528]
C44  0.1µF  [CAP 0201_0603]
C45  47pF  [CAP 0201_0603]
C46  47pF  [CAP 0201_0603]
C47  47pF  [CAP 0201_0603]
C48  47pF  [CAP 0201_0603]
C49  3pF  [CAP 0201_0603 RF]
C50  15pF  [CAP 0201_0603]
C51  47pF  [CAP 0201_0603]
C52  0.1µF  [CAP 0201_0603]
C53  0.1µF  [CAP 0201_0603]
D7  DT1042-04SO-7  [DIODES SOT-23-6 W6]
D8  Green  [LED 0402_1005 GREEN]
IC10  TXB0108PWR  [TI TSSOP-20 PW]
IC11  CSD13381F4  [TI 3-XFDFN F4 YJC]
J2  SIM8060-6-1-14-00-A  [GCT SIM8060-6-1-14-00-A]
L3  6.8nH  [IND 0402_1005 RF WW]
R25  1 kOhms  [RES 0201_0603]

### Ports
LTE_IO (out, harness LTE)

### Harnesses
LTE: I2C_SCL, I2C_SDA, LTE_RESET, LTE_3V3_RX, LTE_3V3_TX, LTE_3V3_CTS, LTE_3V3_RTS, LTE_3V3_DTR, LTE_3V3_DCD, LTE_3V3_RI, LTE_3V3_DSR

### Nets
1V8: A4.4(V_INT) C52.2 IC10.2(VCCA) IC10.10(OE)
3V3: C53.2 IC10.19(VCCB) R25.1
3V8: A4.51(VCC) A4.52(VCC) A4.53(VCC) C40.2 C41.2 C42.1 C43.1 C50.2 C51.2
GND: A4.1(GND) A4.3(GND) A4.5(GND) A4.14(GND) A4.20(GND) A4.21(GND) A4.22(GND) A4.30(GND) A4.32(GND) A4.43(GND) A4.50(GND) A4.54(GND) A4.55(GND) A4.57(GND) A4.58(GND) A4.59(GND) A4.60(GND) A4.61(GND) A4.63(GND) A4.64(GND) A4.65(GND) A4.66(GND) A4.67(GND) A4.68(GND) A4.69(GND) A4.70(GND) A4.71(GND) A4.72(GND) A4.73(GND) A4.74(GND) A4.75(GND) A4.76(GND) A4.77(GND) A4.78(GND) A4.79(GND) A4.80(GND) A4.81(GND) A4.82(GND) A4.83(GND) A4.84(GND) A4.85(GND) A4.86(GND) A4.87(GND) A4.88(GND) A4.89(GND) A4.90(GND) A4.91(GND) A4.92(GND) A4.93(GND) A4.94(GND) A4.95(GND) A4.96(GND) A5.G C40.1 C41.1 C42.2 C43.2 C44.1 C45.1 C46.1 C47.1 C48.1 C50.1 C51.1 C52.1 C53.1 D7.2(GND) D7.5(VBUS) IC10.11(GND) IC11.S J2.C5(GND) J2.S(SHLD) L3.1
VSIM: A4.41(VSIM) C44.2 C45.2 D7.1(I/O_1) J2.C1(VCC)
I2C_SCL: A4.27(SCL) ; port LTE_IO.I2C_SCL
I2C_SDA: A4.26(SDA) ; port LTE_IO.I2C_SDA
LTE_1V8_CTS: A4.11(CTS) IC10.4(A3)
LTE_1V8_DCD: A4.8(DCD) IC10.7(A6)
LTE_1V8_DSR: A4.6(DSR) IC10.9(A8)
LTE_1V8_DTR: A4.9(DTR) IC10.6(A5)
LTE_1V8_RI: A4.7(RI) IC10.8(A7)
LTE_1V8_RTS: A4.10(RTS) IC10.5(A4)
LTE_1V8_RX: A4.13(RXD) IC10.1(A1)
LTE_1V8_TX: A4.12(TXD) IC10.3(A2)
LTE_3V3_CTS: IC10.17(B3) ; port LTE_IO.LTE_3V3_CTS
LTE_3V3_DCD: IC10.15(B5) ; port LTE_IO.LTE_3V3_DCD
LTE_3V3_DSR: IC10.12(B8) ; port LTE_IO.LTE_3V3_DSR
LTE_3V3_DTR: IC10.14(B6) ; port LTE_IO.LTE_3V3_DTR
LTE_3V3_RI: IC10.13(B7) ; port LTE_IO.LTE_3V3_RI
LTE_3V3_RTS: IC10.16(B4) ; port LTE_IO.LTE_3V3_RTS
LTE_3V3_RX: IC10.20(B1) ; port LTE_IO.LTE_3V3_RX
LTE_3V3_TX: IC10.18(B2) ; port LTE_IO.LTE_3V3_TX
LTE_GPIO1: A4.16(GPIO1) IC11.G
LTE_RESET: A4.18(~{RESET}) ; port LTE_IO.LTE_RESET
SIM_CLK: A4.38(SIM_CLK) C48.2 D7.6(I/O_4) J2.C3(CLK)
SIM_IO: A4.39(SIM_IO) C47.2 D7.4(I/O_3) J2.C7(I/O)
SIM_RST: A4.40(SIM_RST) C46.2 D7.3(I/O_2) J2.C2(RST)
NetA4_56: A4.56(ANT) C49.1
NetA5_S: A5.S C49.2 L3.2
NetD8_1: D8.1 R25.2
NetD8_2: D8.2 IC11.D

Not connected (* = marked no-connect by the designer): A4 15(PWR_ON) 17(VUSB_D) 19(GPIO6) 23(GPIO2) 24(GPIO3) 25(GPIO4) 28(USB_D-) 29(USB_D+) 34(I2S_WA/SPI_MOSI) 35(I2S_TXD/SPI_CS) 36(I2S_CLK/SPI_CLK) 37(I2S_RXD/SPI_MISO) 42(GPIO5) 44(SDIO_D2) 45(SDIO_CLK) 46(SDIO_CMD) 47(SDIO_D0) 48(SDIO_D3) 49(SDIO_D1) 62(ANT_DET); J2 C6(Vpp) SW

### Layout directives
net class RF: NetA4_56, NetA5_S

### Notes on the sheet
- Title
- Size:
- Date:
- A4
- Number:
- Time:
- Revision:
- Sheet
- of
- File:

### Library data of the parts
A4 = SARA-R410M-02B-01: RF TXRX CELL 4G LTE CATM1/NB-IOT; Manufacturer: U-Blox America Inc.; Antenna Type: Antenna Not Included, Castellation; Current - Transmitting: 100mA ~ 490mA; Frequency: 700MHz, 850MHz, 1.7GHz, 1.9GHz; RF Family/Standard: Cellular; Sensitivity: -107.5dBm; Serial Interfaces: I²C, SPI, UART, USB; Voltage - Supply: 3.2V ~ 4.2V; Part Number: SARA-R410M-02B-01; ComponentLink1Description: Datasheet; ComponentLink1URL: https://www.u-blox.com/sites/default/files/SARA-R4-N4_DataSheet_%28UBX-16024152%29.pdf; ComponentLink2Description: DigiKey Link; ComponentLink2URL: http://digikey.com/product-detail/en/u-blox-america-inc/SARA-R410M-02B-01/672-SARA-R410M-02B-01CT-ND/9565823; Device Package: 96-SMD Module; LastUpdated: 31/01/2020 01:23:17; Lifecycle Status: Active; Minimum Order: 1; Mounting Type: Surface Mount; Operating Temperature: -40°C ~ 85°C; Package / Case: 96-SMD Module; Packaging: TapeAndReel; Part Status: Active; Price: 21.39; Protocol: 4G LTE CAT M1/NB-IoT; Series: SARA-R4; Supplier 1: DigiKey; Supplier Part Number 1: 672-SARA-R410M-02B-01CT-ND
A5 = ANT-LTE-CER-T: RF ANT 829MHZ/1.94GHZ CHIP SLD; Manufacturer: Linx Technologies Inc.; Frequency (Center/Band): 829MHz, 1.94GHz, 2.35GHz, 2.6GHz; Frequency Group: Wide Band; Frequency Range: 698MHz ~ 960MHz, 1.71GHz ~ 2.17GHz, 2.3GHz ~ 2.4GHz, 2.5GHz ~ 2.7GHz; Gain: 4dBi; Number of Bands: 4; RF Family/Standard: Cellular; VSWR: 4, 3.2, 2.5, 2.5; Part Number: ANT-LTE-CER-T; Antenna Type: Chip; Applications: CAT-M1, Cellular, LTE, NB-IOT, 3G, 4G; ComponentLink1Description: Datasheet; ComponentLink1URL: https://linxtechnologies.com/wp/wp-content/uploads/ant-lte-cer.pdf; ComponentLink2Description: DigiKey Link; ComponentLink2URL: http://digikey.com/product-detail/en/linx-technologies-inc/ANT-LTE-CER-T/ANT-LTE-CER-TCT-ND/8556788; Height (Max): 0.203" (5.15mm); LastUpdated: 30/03/2020 15:23:26; Lifecycle Status: Active; Minimum Order: 1; Mounting Type: Surface Mount; Packaging: TapeAndReel; Part Status: Active; Price: 3.43; Series: CER; Supplier 1: DigiKey; Supplier Part Number 1: ANT-LTE-CER-TCT-ND; Termination: Solder
C40 C44 C52 C53 = GRM033R61C104ME84D: as C14 on sheet Battery; Part Number: GRM033R61C104ME84D; Value: 0.1µF; Applications: General Purpose; Capacitance: 0.1µF; ComponentLink1Description: Datasheet; ComponentLink1URL: https://search.murata.co.jp/Ceramy/image/img/A01X/G101/ENG/GRM033R61C104ME84-01.pdf; ComponentLink2Description: DigiKey Link; ComponentLink2URL: http://digikey.com/product-detail/en/murata-electronics/GRM033R61C104ME84D/490-9986-1-ND/5026291; Device Package: 0201 (0603 Metric); LastUpdated: 21/01/2020 00:00:12; Lifecycle Status: Active; Minimum Order: 1; Mounting Type: Surface Mount, MLCC; Operating Temperature: -55°C ~ 85°C; Package / Case: 0201 (0603 Metric); Packaging: TapeAndReel; PartId: 1522; Part Status: Active; Price: 0.01; Series: GRM; Size / Dimension: 0.024" L x 0.012" W (0.60mm x 0.30mm); Supplier 1: DigiKey; Supplier Part Number 1: 490-9986-1-ND; Temperature Coefficient: X5R; Thickness (Max): 0.013" (0.33mm); Voltage - Rated: 16V
C41 = CGA1A2X7R0J103M030BA: CAP CER 10000PF 6.3V X7R 0201; Manufacturer: TDK Corporation; Tolerance: ±20%; Part Number: CGA1A2X7R0J103M030BA; Value: 10000pF; Applications: Automotive; Capacitance: 10000pF; ComponentLink1Description: Datasheet; ComponentLink1URL: https://product.tdk.com/info/en/catalog/datasheets/mlcc_automotive_general_en.pdf?ref_disty=digikey; ComponentLink2Description: DigiKey Link; ComponentLink2URL: http://digikey.com/product-detail/en/tdk-corporation/CGA1A2X7R0J103M030BA/445-12116-1-ND/3953782; Device Package: 0201 (0603 Metric); LastUpdated: 21/01/2020 00:00:11; Lifecycle Status: Active; Minimum Order: 1; Mounting Type: Surface Mount, MLCC; Operating Temperature: -55°C ~ 125°C; Package / Case: 0201 (0603 Metric); Packaging: TapeAndReel; PartId: 1683; Part Status: Active; Price: 0.01; Ratings: AEC-Q200; Series: CGA; Size / Dimension: 0.024" L x 0.012" W (0.60mm x 0.30mm); Supplier 1: DigiKey; Supplier Part Number 1: 445-12116-1-ND; Temperature Coefficient: X7R; Thickness (Max): 0.013" (0.33mm); Voltage - Rated: 6.3V
C42 C43 = F950J477MBAAQ2: CAP TANT 470UF 20% 6.3V 1411; Manufacturer: AVX Corporation; Manufacturer Size Code: B; ESR (Equivalent Series Resistance): 500mOhm @ 100kHz; Lifetime @ Temp.: 2000 Hrs @ 85°C; Type: Conformal Coated; Part Number: F950J477MBAAQ2; Value: 470µF; Capacitance: 470µF; ComponentLink1Description: Datasheet; ComponentLink1URL: http://datasheets.avx.com/F95.pdf; ComponentLink2Description: DigiKey Link; ComponentLink2URL: http://digikey.com/product-detail/en/avx-corporation/F950J477MBAAQ2/478-10647-1-ND/7423938; Device Package: 1411 (3528 Metric); Features: General Purpose; Height - Seated (Max): 0.079" (2.00mm); LastUpdated: 21/01/2020 01:52:25; Lifecycle Status: Active; Minimum Order: 1; Mounting Type: Surface Mount; Operating Temperature: -55°C ~ 125°C; Package / Case: 1411 (3528 Metric); Packaging: TapeAndReel; PartId: 2180; Part Status: Active; Price: 0.63; Series: F95, Frameless™; Size / Dimension: 0.138" L x 0.110" W (3.50mm x 2.80mm); Supplier 1: DigiKey; Supplier Part Number 1: 478-10647-1-ND; Tolerance: ±20%; Voltage - Rated: 6.3V
C45-C48 C51 = C0201C470K3GAC7867: CAP CER 47PF 25V NP0 0201; Manufacturer: KEMET; Temperature Coefficient: C0G, NP0; Tolerance: ±10%; Part Number: C0201C470K3GAC7867; Value: 47pF; Applications: General Purpose; Capacitance: 47pF; ComponentLink1Description: Datasheet; ComponentLink1URL: https://api.kemet.com/component-edge/download/datasheet/C0201C470K3GAC7867.pdf; ComponentLink2Description: DigiKey Link; ComponentLink2URL: http://digikey.com/product-detail/en/kemet/C0201C470K3GAC7867/399-14263-1-ND/6827254; Device Package: 0201 (0603 Metric); Features: Low ESL; LastUpdated: 21/01/2020 00:00:12; Lifecycle Status: Active; Minimum Order: 1; Mounting Type: Surface Mount, MLCC; Operating Temperature: -55°C ~ 125°C; Package / Case: 0201 (0603 Metric); Packaging: TapeAndReel; PartId: 1548; Part Status: Active; Price: 0.01; Series: SMD Comm C0G; Size / Dimension: 0.024" L x 0.012" W (0.60mm x 0.30mm); Supplier 1: DigiKey; Supplier Part Number 1: 399-14263-1-ND; Thickness (Max): 0.013" (0.33mm); Voltage - Rated: 25V
C49 = GJM0335C1E3R0CB01D: CAP CER 3PF 25V C0G/NP0 0201; Manufacturer: Murata Electronics; Temperature Coefficient: C0G, NP0; Tolerance: ±0.25pF; Part Number: GJM0335C1E3R0CB01D; Applications: RF, Microwave, High Frequency; Capacitance: 3pF; ComponentLink1Description: Datasheet; ComponentLink1URL: https://search.murata.co.jp/Ceramy/image/img/A01X/G101/ENG/GJM0335C1E3R0CB01-01.pdf; ComponentLink2Description: DigiKey Link; ComponentLink2URL: http://digikey.com/product-detail/en/murata-electronics/GJM0335C1E3R0CB01D/490-3064-1-ND/702330; Device Package: 0201 (0603 Metric); Features: High Q, Low Loss; LastUpdated: 21/01/2020 02:09:19; Lifecycle Status: Active; Minimum Order: 1; Mounting Type: Surface Mount, MLCC; Operating Temperature: -55°C ~ 125°C; Package / Case: 0201 (0603 Metric); Packaging: TapeAndReel; PartId: 337; Part Status: Active; Price: 0.01; Series: GJM; Size / Dimension: 0.024" L x 0.012" W (0.60mm x 0.30mm); Supplier 1: DigiKey; Supplier Part Number 1: 490-3064-1-ND; Thickness (Max): 0.013" (0.33mm); Value: 3pF; Voltage - Rated: 25V
C50 = CGA1A2C0G1E150J030BA: CAP CER 15PF 25V C0G 0201; Manufacturer: TDK Corporation; Temperature Coefficient: C0G, NP0; Tolerance: ±5%; Part Number: CGA1A2C0G1E150J030BA; Value: 15pF; Applications: Automotive; Capacitance: 15pF; ComponentLink1Description: Datasheet; ComponentLink1URL: https://product.tdk.com/info/en/catalog/datasheets/mlcc_automotive_general_en.pdf?ref_disty=digikey; ComponentLink2Description: DigiKey Link; ComponentLink2URL: http://digikey.com/product-detail/en/tdk-corporation/CGA1A2C0G1E150J030BA/445-9034-1-ND/3648614; Device Package: 0201 (0603 Metric); LastUpdated: 21/01/2020 00:00:11; Lifecycle Status: Active; Minimum Order: 1; Mounting Type: Surface Mount, MLCC; Operating Temperature: -55°C ~ 125°C; Package / Case: 0201 (0603 Metric); Packaging: TapeAndReel; PartId: 1675; Part Status: Active; Price: 0.01; Ratings: AEC-Q200; Series: CGA; Size / Dimension: 0.024" L x 0.012" W (0.60mm x 0.30mm); Supplier 1: DigiKey; Supplier Part Number 1: 445-9034-1-ND; Thickness (Max): 0.013" (0.33mm); Voltage - Rated: 25V
D7 = DT1042-04SO-7: TVS DIODE 5V 9V SOT26; Manufacturer: Diodes Incorporated; Current - Peak Pulse (10/1000µs): 6A (8/20µs); Power Line Protection: Yes; Power - Peak Pulse: 55W; Type: Steering (Rail to Rail); Unidirectional Channels: 4; Voltage - Breakdown (Min): 6.2V; Voltage - Reverse Standoff (Typ): 5V (Max); Part Number: DT1042-04SO-7; Applications: HDMI; ComponentLink1Description: Datasheet; ComponentLink1URL: https://www.diodes.com/assets/Datasheets/DT1042-04SO.pdf; ComponentLink2Description: DigiKey Link; ComponentLink2URL: http://digikey.com/product-detail/en/diodes-incorporated/DT1042-04SO-7/DT1042-04SO-7DICT-ND/4457893; Device Package: SOT-23-6; LastUpdated: 30/03/2020 16:25:53; Lifecycle Status: Active; Minimum Order: 1; Mounting Type: Surface Mount; Operating Temperature: -55°C ~ 85°C (TA); Package / Case: SOT-23-6; Packaging: TapeAndReel; PartId: 10505; Part Status: Active; Price: 0.08; Series: -; Supplier 1: DigiKey; Supplier Part Number 1: DT1042-04SO-7DICT-ND; Supplier Device Package: SOT-26; Voltage - Clamping (Max) @ Ipp: 9V
D8 = QBLP595-IG: LED GREEN CLEAR 0402 SMD; Manufacturer: QT Brightek (QTB); Configuration: Standard; Current - Test: 20mA; Lens Color: Colorless; Lens Size: 0.70mm x 0.50mm; Lens Style: Rectangle with Flat Top; Millicandela Rating: 600mcd; Viewing Angle: 140°; Voltage - Forward (Vf) (Typ): 3.1V; Wavelength - Dominant: 520nm; Part Number: QBLP595-IG; Color: Green; ComponentLink1Description: Datasheet; ComponentLink1URL: http://www.qt-brightek.com/datasheet/QBLP595 Series.pdf; ComponentLink2Description: DigiKey Link; ComponentLink2URL: http://digikey.com/product-detail/en/qt-brightek-qtb/QBLP595-IG/1516-1216-1-ND/6201913; Device Package: 0402 (1005 Metric); Height (Max): 0.60mm; LastUpdated: 21/01/2020 03:11:39; Lens Transparency: Clear; Lifecycle Status: Active; Minimum Order: 1; Mounting Type: Surface Mount; Package / Case: 0402 (1005 Metric); Packaging: TapeAndReel; PartId: 717; Part Status: Active; Price: 0.08; Series: QBLP595; Size / Dimension: 1.00mm L x 0.50mm W; Supplier 1: DigiKey; Supplier Part Number 1: 1516-1216-1-ND; Supplier Device Package: 0402; Value: Green
IC10 = TXB0108PWR: IC TRNSLTR BIDIRECTIONAL 20TSSOP; Manufacturer: Texas Instruments; Channels per Circuit: 8; Data Rate: 100Mbps; Number of Circuits: 1; Output Type: Tri-State, Non-Inverted; Translator Type: Voltage Level; Voltage - VCCA: 1.2V ~ 3.6V; Voltage - VCCB: 1.65V ~ 5.5V; Part Number: TXB0108PWR; Channel Type: Bidirectional; ComponentLink1Description: Datasheet; ComponentLink1URL: http://www.ti.com/general/docs/suppproductinfo.tsp?distId=10&gotoUrl=http%3A%2F%2Fwww.ti.com%2Flit%2Fgpn%2Ftxb0108; ComponentLink2Description: DigiKey Link; ComponentLink2URL: http://digikey.com/product-detail/en/texas-instruments/TXB0108PWR/296-21527-1-ND/1305700; Device Package: 20-TSSOP (0.173", 4.40mm Width); Features: Auto-Direction Sensing; LastUpdated: 30/03/2020 16:25:06; Lifecycle Status: Active; Minimum Order: 1; Mounting Type: Surface Mount; Operating Temperature: -40°C ~ 85°C (TA); Package / Case: 20-TSSOP (0.173", 4.40mm Width); Packaging: TapeAndReel; Part Status: Active; Price: 0.69; Series: -; Supplier 1: DigiKey; Supplier Part Number 1: 296-21527-1-ND; Supplier Device Package: 20-TSSOP
IC11 = CSD13381F4: MOSFET N-CH 12V 2.1A 3PICOSTAR; Manufacturer: Texas Instruments; Current - Continuous Drain (Id) @ 25°C: 2.1A (Ta); Drive Voltage (Max Rds On,  Min Rds On): 1.8V, 4.5V; FET Type: N-Channel; Gate Charge (Qg) (Max) @ Vgs: 1.4nC @ 4.5V; Input Capacitance (Ciss) (Max) @ Vds: 200pF @ 6V; Power Dissipation (Max): 500mW (Ta); Rds On (Max) @ Id, Vgs: 180mOhm @ 500mA, 4.5V; Vgs (Max): 8V; Vgs(th) (Max) @ Id: 1.1V @ 250µA; Part Number: CSD13381F4; ComponentLink1Description: Datasheet; ComponentLink1URL: http://www.ti.com/general/docs/suppproductinfo.tsp?distId=10&gotoUrl=http%3A%2F%2Fwww.ti.com%2Flit%2Fgpn%2Fcsd13381f4; ComponentLink2Description: DigiKey Link; ComponentLink2URL: http://digikey.com/product-detail/en/texas-instruments/CSD13381F4/296-38912-1-ND/5143018; Device Package: 3-XFDFN; Drain to Source Voltage (Vdss): 12V; LastUpdated: 30/03/2020 15:00:54; Lifecycle Status: Active; Minimum Order: 1; Mounting Type: Surface Mount; Operating Temperature: -55°C ~ 150°C (TJ); Package / Case: 3-XFDFN; Packaging: TapeAndReel; Part Status: Active; Price: 0.07; Series: NexFET™; Supplier 1: DigiKey; Supplier Part Number 1: 296-38912-1-ND; Supplier Device Package: 3-PICOSTAR; Technology: MOSFET (Metal Oxide)
J2 = SIM8060-6-1-14-00-A: CONN SIM NANO HINGED 6P W/SWITCH; Manufacturer: GCT; Card Type: NANO SIM; Connector Type: Connector and Ejector; Insertion, Removal Method: Hinged Lid; Number of Positions: 6; Part Number: SIM8060-6-1-14-00-A; ComponentLink1Description: Datasheet; ComponentLink1URL: https://gct.co/files/drawings/sim8060.pdf; ComponentLink2Description: DigiKey Link; ComponentLink2URL: http://digikey.com/product-detail/en/gct/SIM8060-6-1-14-00-A/2073-SIM8060-6-1-14-00-ACT-ND/10127236; Contact Finish: Gold; Contact Finish Thickness: 1.00µin (0.025µm); Height Above Board: 0.056" (1.42mm); LastUpdated: 30/03/2020 15:26:01; Lifecycle Status: Active; Minimum Order: 1; Mounting Feature: Normal, Standard - Top; Mounting Type: Surface Mount, Right Angle; Packaging: TapeAndReel; Part Status: Active; Price: 0.70; Series: SIM8060; Supplier 1: DigiKey; Supplier Part Number 1: 2073-SIM8060-6-1-14-00-ACT-ND
L3 = LQW15AN6N8J8ZD: FIXED IND 6.8NH 1.45A 68 MOHM; Manufacturer: Murata Electronics; DC Resistance (DCR): 68mOhm Max; Frequency - Self Resonant: 7GHz; Inductance Frequency - Test: 100MHz; Material - Core: Non-Magnetic; Q @ Freq: 30 @ 250MHz; Shielding: Unshielded; Tolerance: ±5%; Type: Wirewound; Part Number: LQW15AN6N8J8ZD; ComponentLink1Description: Datasheet; ComponentLink1URL: https://search.murata.co.jp/Ceramy/image/img/P02/JELF243A-9138.pdf; ComponentLink2Description: DigiKey Link; ComponentLink2URL: http://digikey.com/product-detail/en/murata-electronics/LQW15AN6N8J8ZD/490-15562-1-ND/6800227; Current Rating (Amps): 1.45A; Device Package: 0402 (1006 Metric); Height - Seated (Max): 0.024" (0.60mm); Inductance: 6.8nH; LastUpdated: 21/01/2020 03:29:12; Lifecycle Status: Active; Minimum Order: 1; Mounting Type: Surface Mount; Operating Temperature: -55°C ~ 125°C; Package / Case: 0402 (1006 Metric); Packaging: TapeAndReel; PartId: 139; Part Status: Active; Price: 0.07; Ratings: AEC-Q200; Series: LQW15; Size / Dimension: 0.039" L x 0.024" W (1.00mm x 0.60mm); Supplier 1: DigiKey; Supplier Part Number 1: 490-15562-1-ND; Value: 6.8nH
R25 = ERJ-1GNF1001C: RES SMD 1K OHM 1% 1/20W 0201; Manufacturer: Panasonic Electronic Components; Power (Watts): 0.05W, 1/20W; Temperature Coefficient: ±200ppm/°C; Part Number: ERJ-1GNF1001C; Value: 1 kOhms; ComponentLink1Description: Datasheet; ComponentLink1URL: https://industrial.panasonic.com/cdbs/www-data/pdf/RDA0000/AOA0000C304.pdf; ComponentLink2Description: DigiKey Link; ComponentLink2URL: http://digikey.com/product-detail/en/panasonic-electronic-components/ERJ-1GNF1001C/P122413CT-ND/7389439; Composition: Thick Film; Device Package: 0201 (0603 Metric); Features: Automotive AEC-Q200; Height - Seated (Max): 0.010" (0.26mm); LastUpdated: 21/01/2020 00:04:13; Lifecycle Status: Active; Minimum Order: 1; Number of Terminations: 2; Operating Temperature: -55°C ~ 125°C; Package / Case: 0201 (0603 Metric); Packaging: TapeAndReel; PartId: 2298; Part Status: Active; Price: 0.01; Ratings: AEC-Q200; Resistance: 1 kOhms; Series: ERJ; Size / Dimension: 0.024" L x 0.012" W (0.60mm x 0.30mm); Supplier 1: DigiKey; Supplier Part Number 1: P122413CT-ND; Supplier Device Package: 0201; Tolerance: ±1%